# EAGLE schematic main (EAGLE 7.6.0)
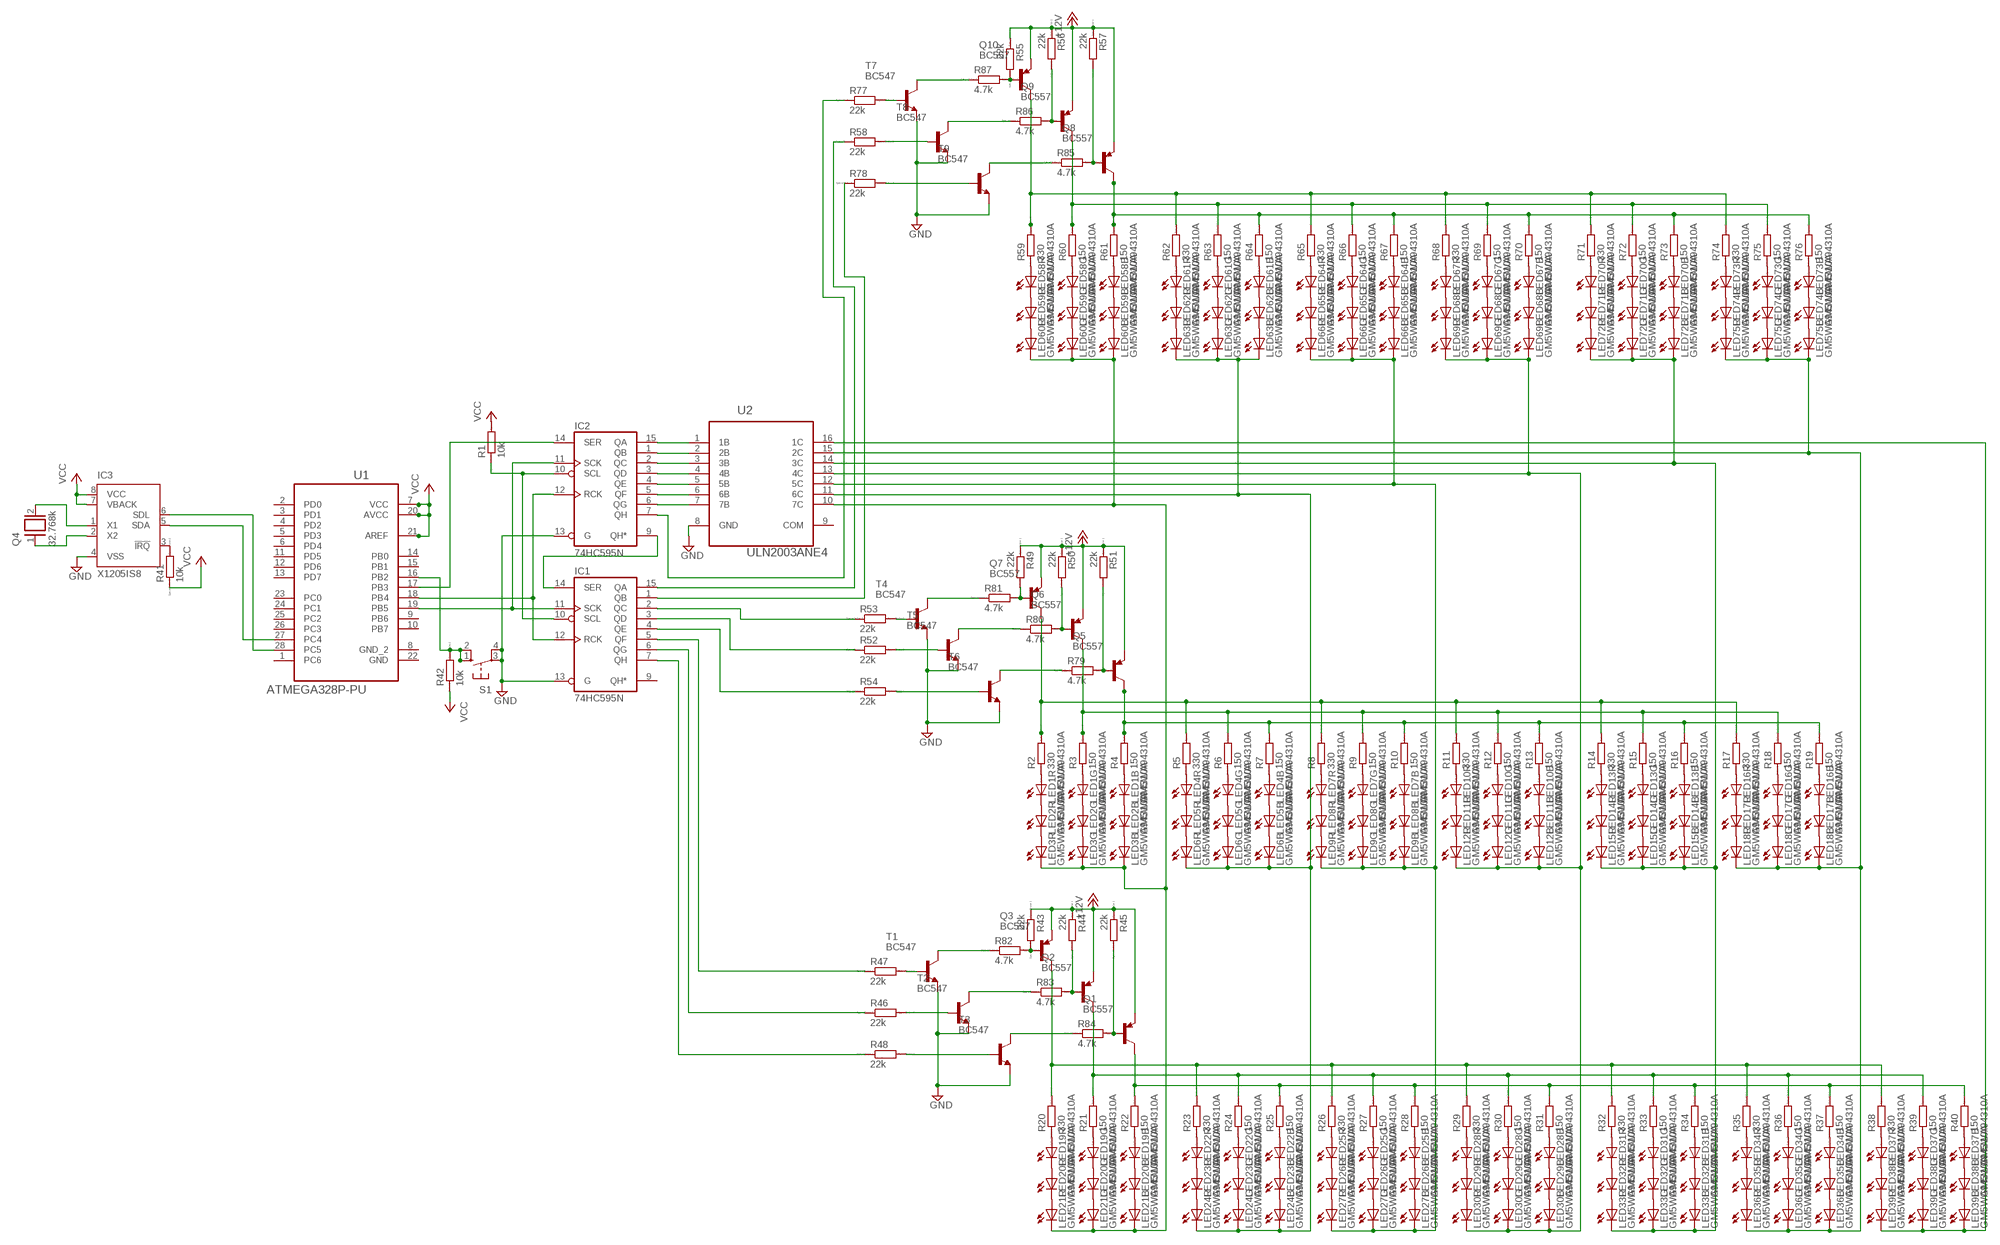
[diagram p0: schematic, sheet 1]

## Parts
IC1  74HC595N  [DIL16]
IC2  74HC595N  [DIL16]
IC3  X1205IS8  [SO-08]
LED1  GM5WA94310A  [GM5WA94310A]
LED2  GM5WA94310A  [GM5WA94310A]
LED3  GM5WA94310A  [GM5WA94310A]
LED4  GM5WA94310A  [GM5WA94310A]
LED5  GM5WA94310A  [GM5WA94310A]
LED6  GM5WA94310A  [GM5WA94310A]
LED7  GM5WA94310A  [GM5WA94310A]
LED8  GM5WA94310A  [GM5WA94310A]
LED9  GM5WA94310A  [GM5WA94310A]
LED10  GM5WA94310A  [GM5WA94310A]
LED11  GM5WA94310A  [GM5WA94310A]
LED12  GM5WA94310A  [GM5WA94310A]
LED13  GM5WA94310A  [GM5WA94310A]
LED14  GM5WA94310A  [GM5WA94310A]
LED15  GM5WA94310A  [GM5WA94310A]
LED16  GM5WA94310A  [GM5WA94310A]
LED17  GM5WA94310A  [GM5WA94310A]
LED18  GM5WA94310A  [GM5WA94310A]
LED19  GM5WA94310A  [GM5WA94310A]
LED20  GM5WA94310A  [GM5WA94310A]
LED21  GM5WA94310A  [GM5WA94310A]
LED22  GM5WA94310A  [GM5WA94310A]
LED23  GM5WA94310A  [GM5WA94310A]
LED24  GM5WA94310A  [GM5WA94310A]
LED25  GM5WA94310A  [GM5WA94310A]
LED26  GM5WA94310A  [GM5WA94310A]
LED27  GM5WA94310A  [GM5WA94310A]
LED28  GM5WA94310A  [GM5WA94310A]
LED29  GM5WA94310A  [GM5WA94310A]
LED30  GM5WA94310A  [GM5WA94310A]
LED31  GM5WA94310A  [GM5WA94310A]
LED32  GM5WA94310A  [GM5WA94310A]
LED33  GM5WA94310A  [GM5WA94310A]
LED34  GM5WA94310A  [GM5WA94310A]
LED35  GM5WA94310A  [GM5WA94310A]
LED36  GM5WA94310A  [GM5WA94310A]
LED37  GM5WA94310A  [GM5WA94310A]
LED38  GM5WA94310A  [GM5WA94310A]
LED39  GM5WA94310A  [GM5WA94310A]
LED58  GM5WA94310A  [GM5WA94310A]
LED59  GM5WA94310A  [GM5WA94310A]
LED60  GM5WA94310A  [GM5WA94310A]
LED61  GM5WA94310A  [GM5WA94310A]
LED62  GM5WA94310A  [GM5WA94310A]
LED63  GM5WA94310A  [GM5WA94310A]
LED64  GM5WA94310A  [GM5WA94310A]
LED65  GM5WA94310A  [GM5WA94310A]
LED66  GM5WA94310A  [GM5WA94310A]
LED67  GM5WA94310A  [GM5WA94310A]
LED68  GM5WA94310A  [GM5WA94310A]
LED69  GM5WA94310A  [GM5WA94310A]
LED70  GM5WA94310A  [GM5WA94310A]
LED71  GM5WA94310A  [GM5WA94310A]
LED72  GM5WA94310A  [GM5WA94310A]
LED73  GM5WA94310A  [GM5WA94310A]
LED74  GM5WA94310A  [GM5WA94310A]
LED75  GM5WA94310A  [GM5WA94310A]
Q1  BC557  [TO92-EBC]
Q2  BC557  [TO92-EBC]
Q3  BC557  [TO92-EBC]
Q4  32.768k  XTAL/S  [QS]
Q5  BC557  [TO92-EBC]
Q6  BC557  [TO92-EBC]
Q7  BC557  [TO92-EBC]
Q8  BC557  [TO92-EBC]
Q9  BC557  [TO92-EBC]
Q10  BC557  [TO92-EBC]
R1  10k  R0204/7  [0204/7]
R2  330  R0204/7  [0204/7]
R3  150  R0204/7  [0204/7]
R4  150  R0204/7  [0204/7]
R5  330  R0204/7  [0204/7]
R6  150  R0204/7  [0204/7]
R7  150  R0204/7  [0204/7]
R8  330  R0204/7  [0204/7]
R9  150  R0204/7  [0204/7]
R10  150  R0204/7  [0204/7]
R11  330  R0204/7  [0204/7]
R12  150  R0204/7  [0204/7]
R13  150  R0204/7  [0204/7]
R14  330  R0204/7  [0204/7]
R15  150  R0204/7  [0204/7]
R16  150  R0204/7  [0204/7]
R17  330  R0204/7  [0204/7]
R18  150  R0204/7  [0204/7]
R19  150  R0204/7  [0204/7]
R20  330  R0204/7  [0204/7]
R21  150  R0204/7  [0204/7]
R22  150  R0204/7  [0204/7]
R23  330  R0204/7  [0204/7]
R24  150  R0204/7  [0204/7]
R25  150  R0204/7  [0204/7]
R26  330  R0204/7  [0204/7]
R27  150  R0204/7  [0204/7]
R28  150  R0204/7  [0204/7]
R29  330  R0204/7  [0204/7]
R30  150  R0204/7  [0204/7]
R31  150  R0204/7  [0204/7]
R32  330  R0204/7  [0204/7]
R33  150  R0204/7  [0204/7]
R34  150  R0204/7  [0204/7]
R35  330  R0204/7  [0204/7]
R36  150  R0204/7  [0204/7]
R37  150  R0204/7  [0204/7]
R38  330  R0204/7  [0204/7]
R39  150  R0204/7  [0204/7]
R40  150  R0204/7  [0204/7]
R41  10k  R0204/7  [0204/7]
R42  10k  R0204/7  [0204/7]
R43  22k  R0204/7  [0204/7]
R44  22k  R0204/7  [0204/7]
R45  22k  R0204/7  [0204/7]
R46  22k  R0204/7  [0204/7]
R47  22k  R0204/7  [0204/7]
R48  22k  R0204/7  [0204/7]
R49  22k  R0204/7  [0204/7]
R50  22k  R0204/7  [0204/7]
R51  22k  R0204/7  [0204/7]
R52  22k  R0204/7  [0204/7]
R53  22k  R0204/7  [0204/7]
R54  22k  R0204/7  [0204/7]
R55  22k  R0204/7  [0204/7]
R56  22k  R0204/7  [0204/7]
R57  22k  R0204/7  [0204/7]
R58  22k  R0204/7  [0204/7]
R59  330  R0204/7  [0204/7]
R60  150  R0204/7  [0204/7]
R61  150  R0204/7  [0204/7]
R62  330  R0204/7  [0204/7]
R63  150  R0204/7  [0204/7]
R64  150  R0204/7  [0204/7]
R65  330  R0204/7  [0204/7]
R66  150  R0204/7  [0204/7]
R67  150  R0204/7  [0204/7]
R68  330  R0204/7  [0204/7]
R69  150  R0204/7  [0204/7]
R70  150  R0204/7  [0204/7]
R71  330  R0204/7  [0204/7]
R72  150  R0204/7  [0204/7]
R73  150  R0204/7  [0204/7]
R74  330  R0204/7  [0204/7]
R75  150  R0204/7  [0204/7]
R76  150  R0204/7  [0204/7]
R77  22k  R0204/7  [0204/7]
R78  22k  R0204/7  [0204/7]
R79  4.7k  R0204/7  [0204/7]
R80  4.7k  R0204/7  [0204/7]
R81  4.7k  R0204/7  [0204/7]
R82  4.7k  R0204/7  [0204/7]
R83  4.7k  R0204/7  [0204/7]
R84  4.7k  R0204/7  [0204/7]
R85  4.7k  R0204/7  [0204/7]
R86  4.7k  R0204/7  [0204/7]
R87  4.7k  R0204/7  [0204/7]
S1  10-XX  [B3F-10XX]
T1  BC547  [TO92]
T2  BC547  [TO92]
T3  BC547  [TO92]
T4  BC547  [TO92]
T5  BC547  [TO92]
T6  BC547  [TO92]
T7  BC547  [TO92]
T8  BC547  [TO92]
T9  BC547  [TO92]
U1  ATMEGA328P-PU  [DIP254P762X457-28]
U2  ULN2003ANE4  [DIP254P762X508-16]

## Nets
+12V: Q1.E Q2.E Q3.E Q5.E Q6.E Q7.E Q8.E Q9.E Q10.E R43.1 R44.1 R45.1 R49.1 R50.1 R51.1 R55.1 R56.1 R57.1
GND: IC1.13(G) IC2.13(G) IC3.4(VSS) S1.3(P) S1.4(P1) T1.1(E) T2.1(E) T3.1(E) T4.1(E) T5.1(E) T6.1(E) T7.1(E) T8.1(E) T9.1(E) U2.8(GND)
N$1: IC1.14(SER) IC2.9(QH*)
N$2: IC1.12(RCK) IC2.12(RCK) U1.18(PB4)
N$3: IC1.10(SCL) IC2.10(SCL) R1.1
N$4: LED10.5(R:C) LED11.2(R:A)
N$5: IC2.14(SER) U1.17(PB3)
N$6: IC1.11(SCK) IC2.11(SCK) U1.19(PB5)
N$7: IC2.15(QA) U2.1(1B)
N$8: IC2.1(QB) U2.2(2B)
N$9: IC2.2(QC) U2.3(3B)
N$10: IC2.3(QD) U2.4(4B)
N$11: IC2.4(QE) U2.5(5B)
N$12: IC2.5(QF) U2.6(6B)
N$13: IC2.6(QG) U2.7(7B)
N$14: LED1.5(R:C) LED2.2(R:A)
N$15: LED2.5(R:C) LED3.2(R:A)
N$16: LED1.2(R:A) R2.1
N$17: LED1.3(G:A) R3.1
N$18: LED1.1(B:A) R4.1
N$19: LED1.4(G:C) LED2.3(G:A)
N$20: LED1.6(B:C) LED2.1(B:A)
N$21: LED2.4(G:C) LED3.3(G:A)
N$22: LED2.6(B:C) LED3.1(B:A)
N$23: Q5.C R4.2 R7.2 R10.2 R13.2 R16.2 R19.2
N$24: LED3.4(G:C) LED3.5(R:C) LED3.6(B:C) LED21.4(G:C) LED21.5(R:C) LED21.6(B:C) LED60.4(G:C) LED60.5(R:C) LED60.6(B:C) U2.10(7C)
N$25: LED4.5(R:C) LED5.2(R:A)
N$26: LED5.5(R:C) LED6.2(R:A)
N$27: LED4.2(R:A) R5.1
N$28: LED4.3(G:A) R6.1
N$29: LED4.1(B:A) R7.1
N$30: LED4.4(G:C) LED5.3(G:A)
N$31: LED4.6(B:C) LED5.1(B:A)
N$32: LED5.4(G:C) LED6.3(G:A)
N$33: LED5.6(B:C) LED6.1(B:A)
N$34: Q6.C R3.2 R6.2 R9.2 R12.2 R15.2 R18.2
N$35: IC3.3(!IRQ) R41.2
N$36: LED7.5(R:C) LED8.2(R:A)
N$37: LED8.5(R:C) LED9.2(R:A)
N$38: LED7.2(R:A) R8.1
N$39: LED7.3(G:A) R9.1
N$40: LED7.1(B:A) R10.1
N$41: LED7.4(G:C) LED8.3(G:A)
N$42: LED7.6(B:C) LED8.1(B:A)
N$43: LED8.4(G:C) LED9.3(G:A)
N$44: LED8.6(B:C) LED9.1(B:A)
N$45: Q7.C R2.2 R5.2 R8.2 R11.2 R14.2 R17.2
N$46: IC3.6(SDL) U1.28(PC5)
N$47: LED11.5(R:C) LED12.2(R:A)
N$48: LED10.2(R:A) R11.1
N$49: LED10.3(G:A) R12.1
N$50: LED10.1(B:A) R13.1
N$51: LED10.4(G:C) LED11.3(G:A)
N$52: LED10.6(B:C) LED11.1(B:A)
N$53: LED11.4(G:C) LED12.3(G:A)
N$54: LED11.6(B:C) LED12.1(B:A)
N$56: IC3.5(SDA) U1.27(PC4)
N$57: LED13.5(R:C) LED14.2(R:A)
N$58: LED14.5(R:C) LED15.2(R:A)
N$59: LED13.2(R:A) R14.1
N$60: LED13.3(G:A) R15.1
N$61: LED13.1(B:A) R16.1
N$62: LED13.4(G:C) LED14.3(G:A)
N$63: LED13.6(B:C) LED14.1(B:A)
N$64: LED14.4(G:C) LED15.3(G:A)
N$65: LED14.6(B:C) LED15.1(B:A)
N$66: IC1.4(QE) R54.1
N$67: IC3.2(X2) Q4.1
N$68: LED16.5(R:C) LED17.2(R:A)
N$69: LED17.5(R:C) LED18.2(R:A)
N$70: LED16.2(R:A) R17.1
N$71: LED16.3(G:A) R18.1
N$72: LED16.1(B:A) R19.1
N$73: LED16.4(G:C) LED17.3(G:A)
N$74: LED16.6(B:C) LED17.1(B:A)
N$75: LED17.4(G:C) LED18.3(G:A)
N$76: LED17.6(B:C) LED18.1(B:A)
N$77: IC1.3(QD) R52.1
N$78: IC3.1(X1) Q4.2
N$79: LED19.5(R:C) LED20.2(R:A)
N$80: LED20.5(R:C) LED21.2(R:A)
N$81: LED19.2(R:A) R20.1
N$82: LED19.3(G:A) R21.1
N$83: LED19.1(B:A) R22.1
N$84: LED19.4(G:C) LED20.3(G:A)
N$85: LED19.6(B:C) LED20.1(B:A)
N$86: LED20.4(G:C) LED21.3(G:A)
N$87: LED20.6(B:C) LED21.1(B:A)
N$88: R42.2 S1.1(S) S1.2(S1) U1.16(PB2)
N$89: LED22.5(R:C) LED23.2(R:A)
N$90: LED23.5(R:C) LED24.2(R:A)
N$91: LED22.2(R:A) R23.1
N$92: LED22.3(G:A) R24.1
N$93: LED22.1(B:A) R25.1
N$94: LED22.4(G:C) LED23.3(G:A)
N$95: LED22.6(B:C) LED23.1(B:A)
N$96: LED23.4(G:C) LED24.3(G:A)
N$97: LED23.6(B:C) LED24.1(B:A)
N$98: LED6.4(G:C) LED6.5(R:C) LED6.6(B:C) LED24.4(G:C) LED24.5(R:C) LED24.6(B:C) LED63.4(G:C) LED63.5(R:C) LED63.6(B:C) U2.11(6C)
N$99: LED25.5(R:C) LED26.2(R:A)
N$100: LED26.5(R:C) LED27.2(R:A)
N$101: LED25.2(R:A) R26.1
N$102: LED25.3(G:A) R27.1
N$103: LED25.1(B:A) R28.1
N$104: LED25.4(G:C) LED26.3(G:A)
N$105: LED25.6(B:C) LED26.1(B:A)
N$106: LED26.4(G:C) LED27.3(G:A)
N$107: LED26.6(B:C) LED27.1(B:A)
N$108: Q3.B R43.2 R82.2
N$109: LED28.5(R:C) LED29.2(R:A)
N$110: LED29.5(R:C) LED30.2(R:A)
N$111: LED28.2(R:A) R29.1
N$112: LED28.3(G:A) R30.1
N$113: LED28.1(B:A) R31.1
N$114: LED28.4(G:C) LED29.3(G:A)
N$115: LED28.6(B:C) LED29.1(B:A)
N$116: LED29.4(G:C) LED30.3(G:A)
N$117: LED29.6(B:C) LED30.1(B:A)
N$118: LED12.4(G:C) LED12.5(R:C) LED12.6(B:C) LED30.4(G:C) LED30.5(R:C) LED30.6(B:C) LED69.4(G:C) LED69.5(R:C) LED69.6(B:C) U2.13(4C)
N$119: LED31.5(R:C) LED32.2(R:A)
N$120: LED32.5(R:C) LED33.2(R:A)
N$121: LED31.2(R:A) R32.1
N$122: LED31.3(G:A) R33.1
N$123: LED31.1(B:A) R34.1
N$124: LED31.4(G:C) LED32.3(G:A)
N$125: LED31.6(B:C) LED32.1(B:A)
N$126: LED32.4(G:C) LED33.3(G:A)
N$127: LED32.6(B:C) LED33.1(B:A)
N$128: R87.1 T7.3(C)
N$129: LED34.5(R:C) LED35.2(R:A)
N$130: LED35.5(R:C) LED36.2(R:A)
N$131: LED34.2(R:A) R35.1
N$132: LED34.3(G:A) R36.1
N$133: LED34.1(B:A) R37.1
N$134: LED34.4(G:C) LED35.3(G:A)
N$135: LED34.6(B:C) LED35.1(B:A)
N$136: LED35.4(G:C) LED36.3(G:A)
N$137: LED35.6(B:C) LED36.1(B:A)
N$138: LED18.4(G:C) LED18.5(R:C) LED18.6(B:C) LED36.4(G:C) LED36.5(R:C) LED36.6(B:C) LED75.4(G:C) LED75.5(R:C) LED75.6(B:C) U2.15(2C)
N$139: Q1.C R22.2 R25.2 R28.2 R31.2 R34.2 R37.2 R40.2
N$140: Q2.C R21.2 R24.2 R27.2 R30.2 R33.2 R36.2 R39.2
N$141: Q3.C R20.2 R23.2 R26.2 R29.2 R32.2 R35.2 R38.2
N$142: IC1.5(QF) R47.1
N$143: IC1.6(QG) R46.1
N$144: IC1.7(QH) R48.1
N$145: LED37.5(R:C) LED38.2(R:A)
N$146: LED38.5(R:C) LED39.2(R:A)
N$147: LED37.2(R:A) R38.1
N$148: LED37.3(G:A) R39.1
N$149: LED37.1(B:A) R40.1
N$150: LED37.4(G:C) LED38.3(G:A)
N$151: LED37.6(B:C) LED38.1(B:A)
N$152: LED38.4(G:C) LED39.3(G:A)
N$153: LED38.6(B:C) LED39.1(B:A)
N$154: LED39.4(G:C) LED39.5(R:C) LED39.6(B:C) U2.16(1C)
N$155: R86.1 T8.3(C)
N$156: Q2.B R44.2 R83.2
N$157: Q1.B R45.2 R84.2
N$158: R85.1 T9.3(C)
N$159: R48.2 T3.2(B)
N$160: R46.2 T2.2(B)
N$161: R47.2 T1.2(B)
N$162: R79.1 T6.3(C)
N$163: R80.1 T5.3(C)
N$164: IC1.2(QC) R53.1
N$165: IC1.15(QA) R58.1
N$166: IC1.1(QB) R78.1
N$167: Q7.B R49.2 R81.2
N$168: R81.1 T4.3(C)
N$169: R84.1 T3.3(C)
N$170: Q6.B R50.2 R80.2
N$171: Q5.B R51.2 R79.2
N$172: R83.1 T2.3(C)
N$173: R54.2 T6.2(B)
N$174: R52.2 T5.2(B)
N$175: R53.2 T4.2(B)
N$176: R82.1 T1.3(C)
N$182: Q10.B R55.2 R87.2
N$185: Q9.B R56.2 R86.2
N$186: Q8.B R57.2 R85.2
N$188: R78.2 T9.2(B)
N$189: R58.2 T8.2(B)
N$190: R77.2 T7.2(B)
N$222: LED58.5(R:C) LED59.2(R:A)
N$223: LED59.5(R:C) LED60.2(R:A)
N$224: LED58.2(R:A) R59.1
N$225: LED58.3(G:A) R60.1
N$226: LED58.1(B:A) R61.1
N$227: LED58.4(G:C) LED59.3(G:A)
N$228: LED58.6(B:C) LED59.1(B:A)
N$229: LED59.4(G:C) LED60.3(G:A)
N$230: LED59.6(B:C) LED60.1(B:A)
N$232: LED61.5(R:C) LED62.2(R:A)
N$233: LED62.5(R:C) LED63.2(R:A)
N$234: LED61.2(R:A) R62.1
N$235: LED61.3(G:A) R63.1
N$236: LED61.1(B:A) R64.1
N$237: LED61.4(G:C) LED62.3(G:A)
N$238: LED61.6(B:C) LED62.1(B:A)
N$239: LED62.4(G:C) LED63.3(G:A)
N$240: LED62.6(B:C) LED63.1(B:A)
N$242: LED64.5(R:C) LED65.2(R:A)
N$243: LED65.5(R:C) LED66.2(R:A)
N$244: LED64.2(R:A) R65.1
N$245: LED64.3(G:A) R66.1
N$246: LED64.1(B:A) R67.1
N$247: LED64.4(G:C) LED65.3(G:A)
N$248: LED64.6(B:C) LED65.1(B:A)
N$249: LED65.4(G:C) LED66.3(G:A)
N$250: LED65.6(B:C) LED66.1(B:A)
N$251: LED9.4(G:C) LED9.5(R:C) LED9.6(B:C) LED27.4(G:C) LED27.5(R:C) LED27.6(B:C) LED66.4(G:C) LED66.5(R:C) LED66.6(B:C) U2.12(5C)
N$252: LED67.5(R:C) LED68.2(R:A)
N$253: LED68.5(R:C) LED69.2(R:A)
N$254: LED67.2(R:A) R68.1
N$255: LED67.3(G:A) R69.1
N$256: LED67.1(B:A) R70.1
N$257: LED67.4(G:C) LED68.3(G:A)
N$258: LED67.6(B:C) LED68.1(B:A)
N$259: LED68.4(G:C) LED69.3(G:A)
N$260: LED68.6(B:C) LED69.1(B:A)
N$262: LED70.5(R:C) LED71.2(R:A)
N$263: LED71.5(R:C) LED72.2(R:A)
N$264: LED70.2(R:A) R71.1
N$265: LED70.3(G:A) R72.1
N$266: LED70.1(B:A) R73.1
N$267: LED70.4(G:C) LED71.3(G:A)
N$268: LED70.6(B:C) LED71.1(B:A)
N$269: LED71.4(G:C) LED72.3(G:A)
N$270: LED71.6(B:C) LED72.1(B:A)
N$271: LED15.4(G:C) LED15.5(R:C) LED15.6(B:C) LED33.4(G:C) LED33.5(R:C) LED33.6(B:C) LED72.4(G:C) LED72.5(R:C) LED72.6(B:C) U2.14(3C)
N$272: LED73.5(R:C) LED74.2(R:A)
N$273: LED74.5(R:C) LED75.2(R:A)
N$274: LED73.2(R:A) R74.1
N$275: LED73.3(G:A) R75.1
N$276: LED73.1(B:A) R76.1
N$277: LED73.4(G:C) LED74.3(G:A)
N$278: LED73.6(B:C) LED74.1(B:A)
N$279: LED74.4(G:C) LED75.3(G:A)
N$280: LED74.6(B:C) LED75.1(B:A)
N$282: Q8.C R61.2 R64.2 R67.2 R70.2 R73.2 R76.2
N$283: Q9.C R60.2 R63.2 R66.2 R69.2 R72.2 R75.2
N$284: Q10.C R59.2 R62.2 R65.2 R68.2 R71.2 R74.2
N$285: IC2.7(QH) R77.1
VCC: IC3.7(VBACK) IC3.8(VCC) R1.2 R41.1 R42.1 U1.7(VCC) U1.20(AVCC) U1.21(AREF)
Unconnected: IC1.9(QH*) U1.1(PC6) U1.2(PD0) U1.3(PD1) U1.4(PD2) U1.5(PD3) U1.6(PD4) U1.8(GND_2) U1.9(PB6) U1.10(PB7) U1.11(PD5) U1.12(PD6) U1.13(PD7) U1.14(PB0) U1.15(PB1) U1.22(GND) U1.23(PC0) U1.24(PC1) U1.25(PC2) U1.26(PC3) U2.9(COM)

## Power pins joined to a net without a drawn wire
GND: IC1.8(GND) IC2.8(GND)
VCC: IC1.16(VCC) IC2.16(VCC)

## Library data of the parts
IC1 IC2 = 74xx-eu:74*595: 8-bit SHIFT REGISTER, output latch
IC3 = xicor:X1205*: 2-Wire RTC Real Time Clock/Calendar; OC_FARNELL: unknown; OC_NEWARK: unknown
LED1-LED39 LED58-LED75 = led:GM5WA94310A: Chip LED RGB Source: http://document.sharpsma.com/files/GM5WA94310A_SS.pdf
Q1-Q3 Q5-Q10 = transistor-pnp:BC557*: PNP Transistror
Q4 = special:XTAL/S: CRYSTAL
R1-R87 = eagle-ltspice:R: RESISTOR, European symbol; SPICEMODEL: NONE; SPICEPREFIX: R
S1 = switch-omron:10-XX: OMRON SWITCH; MPN: B3F-1000; OC_FARNELL: 176432; OC_NEWARK: 36M3542
T1-T9 = transistor:BC547: NPN TRANSISTOR
U1 = Atmel_By_element14_Batch_1-00:ATMEGA328P-PU: 8-bit Microcontroller with In-System Programmable Flash; MPN: ATMEGA328P-PU; OC_FARNELL: 1715487; OC_NEWARK: 15R0268; PACKAGE: PDIP-28; SUPPLIER: Atmel
U2 = Texas Instruments_By_element14_Batch_1:ULN2003ANE4: HIGH-VOLTAGE, HIGH-CURRENT DARLINGTON TRANSISTOR ARRAYS; MPN: ULN2003ANE4; OC_FARNELL: 1210973; OC_NEWARK: 98K2130; PACKAGE: PDIP-16; SUPPLIER: Texas Instruments